# Altium schematic sheet Sheet3.SchDoc
size A4; SheetNumber: 1; SheetTotal: 1
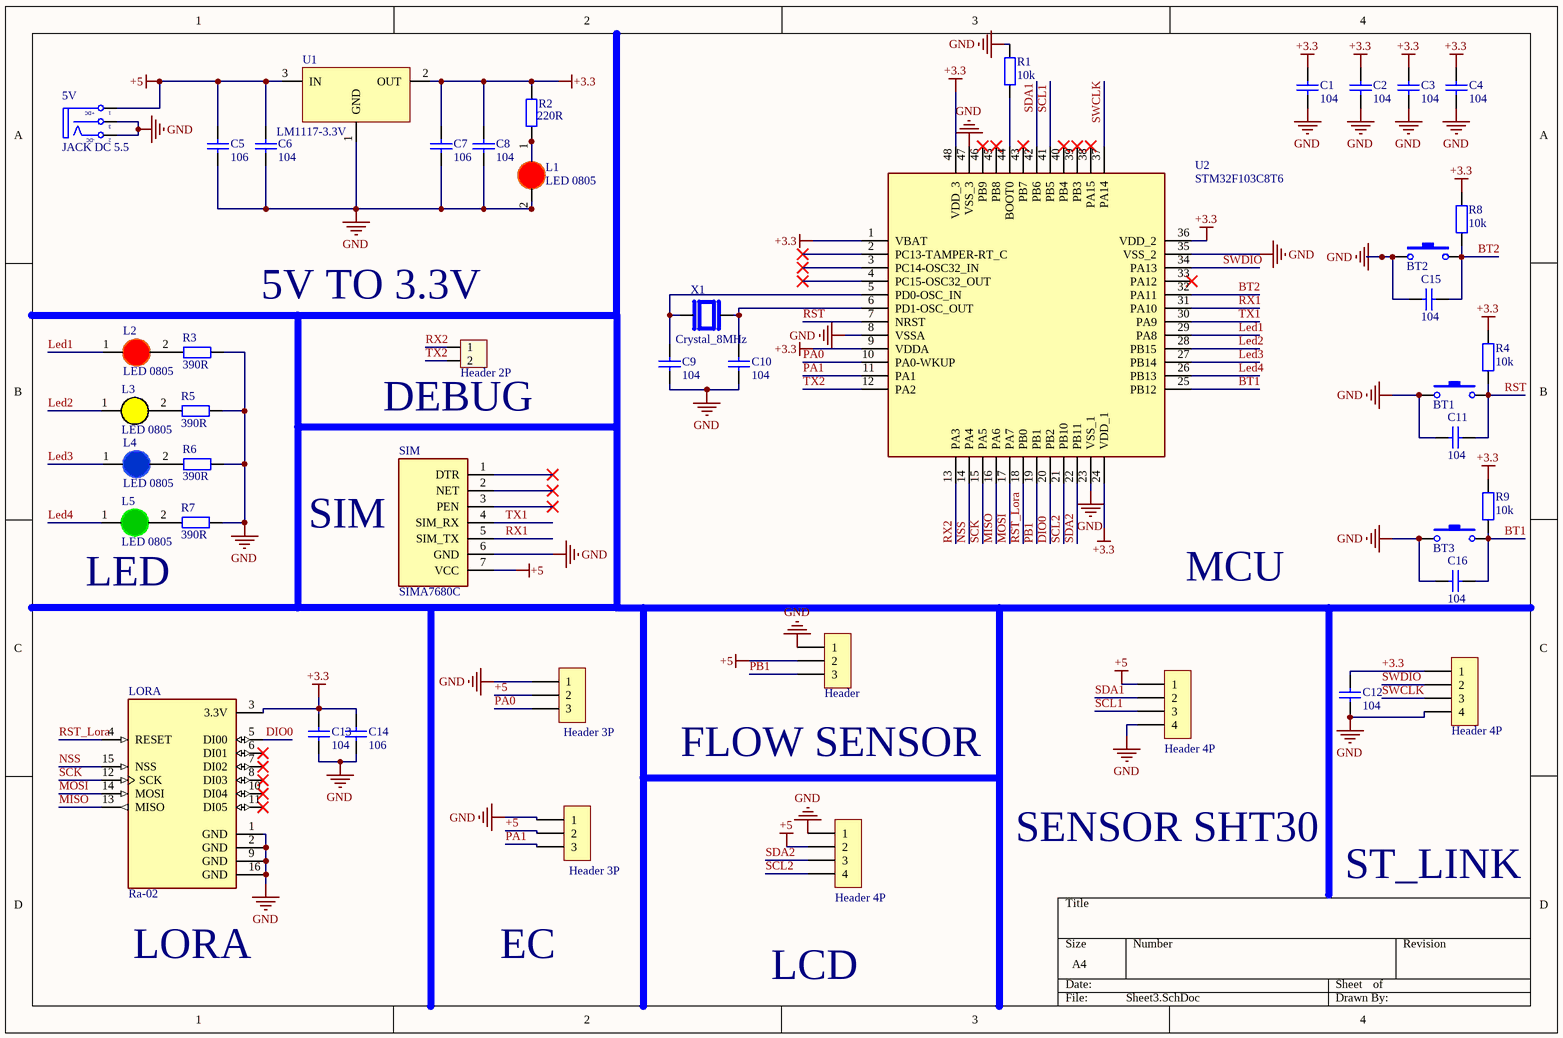
[diagram p0: Sheet3.SchDoc]

## Parts
5V  JACK DC 5.5  [JACK DC 5.5]
BT1  Nut Nhan 2 Chan SMD 3x6x2.5  [Nut Nhan 2 Chan SMD 3x6x2.5]  (value not drawn)
BT2  Nut Nhan 2 Chan SMD 3x6x2.5  [Nut Nhan 2 Chan SMD 3x6x2.5]  (value not drawn)
BT3  Nut Nhan 2 Chan SMD 3x6x2.5  [Nut Nhan 2 Chan SMD 3x6x2.5]  (value not drawn)
C1  104  [tu 1206]
C2  104  [tu 1206]
C3  104  [tu 1206]
C4  104  [tu 1206]
C5  106  [tu 1206]
C6  104  [tu 1206]
C7  106  [tu 1206]
C8  104  [tu 1206]
C9  104  [tu 1206]
C10  104  [tu 1206]
C11  104  [tu 1206]
C12  104  [tu 1206]
C13  104  [tu 1206]
C14  106  [tu 1206]
C15  104  [tu 1206]
C16  104  [tu 1206]
FLOW  Header  [XH2.54M-3]
L1  LED 0805  [LED-1206-Red]
L2  LED 0805  [LED-1206-Red]
L3  LED 0805  [LED-1206-Yellow]
L4  LED 0805  [LED-1206-Blue]
L5  LED 0805  [LED-1206-Green]
LCD  Header 4P  [XH2.54M-4]
LORA  Ra-02  [Sx1278]
R1  10k  [tro smd 1206]
R2  220R  [tro smd 1206]
R3  390R  [Tro smd 1206]
R4  10k  [tro smd 1206]
R5  390R  [Tro smd 1206]
R6  390R  [Tro smd 1206]
R7  390R  [Tro smd 1206]
R8  10k  [tro smd 1206]
R9  10k  [tro smd 1206]
SAL  Header 3P  [XH2.54M-3]
SHT3x  Header 4P  [XH2.54M-4]
SIM  SIMA7680C  [SIMA7680C]
ST  Header 4P  [XH2.54M-4]
TEMP_W  Header 3P  [XH2.54M-3]
U1  LM1117-3.3V  [SOT223]
U2  STM32F103C8T6  [LQFP-48_19.6_393_58X11_SMD]
UART2  Header 2P  [XH2.54M-2]
X1  Crystal_8MHz  [XTAL_8MHz]

## Nets
+3.3: C1.1 C2.1 C3.1 C4.1 C7.1 C8.1 C12.2 C13.1 C14.1 LORA.3(3.3V) R2.2 R4.2 R8.2 R9.2 ST.1 U1.2(OUT) U2.1(VBAT) U2.9(VDDA) U2.24(VDD_1) U2.36(VDD_2) U2.48(VDD_3)
+5: 5V.1(T) C5.1 C6.1 FLOW.2 LCD.2 SAL.2 SHT3x.1 SIM.7(VCC) TEMP_W.2 U1.3(IN)
GND: 5V.2(TN) 5V.3(S) BT1.1 BT2.1 BT3.1 C1.2 C2.2 C3.2 C4.2 C5.2 C6.2 C7.2 C8.2 C9.2 C10.2 C11.1 C12.1 C13.2 C14.2 C15.1 C16.1 FLOW.1 L1.2(K) LCD.1 LORA.1(GND) LORA.2(GND) LORA.9(GND) LORA.16(GND) R1.2 R3.1 R5.2 R6.2 R7.2 SAL.1 SHT3x.4 SIM.6(GND) ST.4 TEMP_W.1 U1.1(GND) U2.8(VSSA) U2.23(VSS_1) U2.35(VSS_2) U2.47(VSS_3)
BT1: BT3.2 C16.2 R9.1 U2.25(PB12)
BT2: BT2.2 C15.2 R8.1 U2.32(PA11)
DIO0: LORA.5(DI00) U2.20(PB2)
Led1: L2.1(A) U2.29(PA8)
Led2: L3.1(A) U2.28(PB15)
Led3: L4.1(A) U2.27(PB14)
Led4: L5.1(A) U2.26(PB13)
MISO: LORA.13(MISO) U2.16(PA6)
MOSI: LORA.14(MOSI) U2.17(PA7)
NSS: LORA.15(NSS) U2.14(PA4)
PA0: SAL.3 U2.10(PA0-WKUP)
PA1: TEMP_W.3 U2.11(PA1)
PB1: FLOW.3 U2.19(PB1)
RST: BT1.2 C11.2 R4.1 U2.7(NRST)
RST_Lora: LORA.4(RESET) U2.18(PB0)
RX1: SIM.5(SIM_TX) U2.31(PA10)
RX2: U2.13(PA3) UART2.1
SCK: LORA.12(SCK) U2.15(PA5)
SCL1: SHT3x.3 U2.41(PB5)
SCL2: LCD.4 U2.21(PB10)
SDA1: SHT3x.2 U2.42(PB6)
SDA2: LCD.3 U2.22(PB11)
SWCLK: ST.3 U2.37(PA14)
SWDIO: ST.2 U2.34(PA13)
TX1: SIM.4(SIM_RX) U2.30(PA9)
TX2: U2.12(PA2) UART2.2
NetC9_1: C9.1 U2.5(PD0-OSC_IN) X1.1
NetC10_1: C10.1 U2.6(PD1-OSC_OUT) X1.2
NetL1_1: L1.1(A) R2.1
NetL2_2: L2.2(K) R3.2
NetL3_2: L3.2(K) R5.1
NetL4_2: L4.2(K) R6.1
NetL5_2: L5.2(K) R7.1
NetR1_1: R1.1 U2.44(BOOT0)

Not connected (* = marked no-connect by the designer): LORA 6(DI01)* 7(DI02)* 8(DI03)* 10(DI04)* 11(DI05)*; SIM 1(DTR)* 2(NET)* 3(PEN)*; U2 2(PC13-TAMPER-RT_C)* 3(PC14-OSC32_IN)* 4(PC15-OSC32_OUT)* 33(PA12)* 38(PA15)* 39(PB3)* 40(PB4)* 43(PB7)* 45(PB8)* 46(PB9)*

## Notes on the sheet
- (near UART2) 5V TO 3.3V
- (near UART2) DEBUG
- SIM
- MCU
- LED
- FLOW SENSOR
- SENSOR SHT30
- ST_LINK
- (near LORA) LORA
- EC
- LCD
- (in symbol JACK DC 5.5) +DC; -DC

## Library data of the parts
5V = JACK DC 5.5: Value: Jac DC
BT1-BT3 = Nut Nhan 2 Chan SMD 3x6x2.5: Ma_Hang: MH001036; Ten: Nút Nhấn 2 Chân 3x6x2.5MM SMD
C1-C4 C6 C8-C13 C15 C16 = Tu 1206 104 50V 20%: Dán; Don_Vi: Con; So_Chan: 2; Ten_Linh_Kien: Tụ 1206 104-0.1uF 20% 50V; Ma_Hang: MH004544; Chung_Loai: Dán; Kieu_Chan: *
C5 C7 C14 = Tu 1206 106 16V 20%: Dán; Don_Vi: Con; So_Chan: 2; Ten_Linh_Kien: Tụ 1206 106-10uF 20% 16V; Ma_Hang: MH004541; Chung_Loai: Dán; Kieu_Chan: *
FLOW SAL TEMP_W = Header 3P 2.54 Duc Thang: Cắm; Ten_Linh_Kien: Header 3P XH2.54-3P Đực Thẳng; Don_Vi: Con; Ma_Hang: MH001292; Chung_Loai: Cắm
L1 L2 = LED 1206 Do: Dán; Don_Vi: Con; Ma_Hang: MH002334; Ten_Linh_Kien: LED1206 Màu Đỏ (Red); Ghi_Chu: *; Kieu_Chan: *; Chung_Loai: Dán
L3 = LED 1206 Vang: Dán; Don_Vi: Con; Ma_Hang: MH002331; Ten_Linh_Kien: LED1206 Màu Vàng (Yellow); Ghi_Chu: *; Kieu_Chan: *; Chung_Loai: Dán
L4 = LED 1206 Xanh Duong: Dán; Don_Vi: Con; Ma_Hang: MH002333; Ten_Linh_Kien: LED1206 Màu Xanh Dương (Blue); Ghi_Chu: *; Kieu_Chan: *; Chung_Loai: Dán
L5 = LED 1206 Xanh La: Dán; Don_Vi: Con; Ma_Hang: MH002947; Ten_Linh_Kien: LED1206 Màu Xanh Lá (Green); Ghi_Chu: *; Kieu_Chan: *; Chung_Loai: Dán
LCD SHT3x ST = Header 4P 2.54 Duc Thang: Cắm; Ten_Linh_Kien: Header 4P XH2.54-4P Đực Thẳng; Don_Vi: Con; Ma_Hang: MH001285; Chung_Loai: Cắm
LORA = Ra-02: Lora sx1278
R1 R4 R8 R9 = Tro 1206 1% 10k: Dán; Don_Vi: Con; So_Chan: 2; Ten_Linh_Kien: Trở 1206 1% 10k; Ma_Hang: MH005885; Chung_Loai: Dán; Kieu_Chan: *
R2 = Tro 1206 1% 220R: Dán; Ma_Hang: MH005897; Don_Vi: Con; So_Chan: 2; Ten_Linh_Kien: Trở 1206 1% 220R; Chung_Loai: Dán; Kieu_Chan: *
R3 R5-R7 = Tro 1206 5% 390R: Dán; Don_Vi: Con; So_Chan: 2; Ten_Linh_Kien: Trở 1206 5% 390R; Ma_Hang: MH005927; Chung_Loai: Dán; Kieu_Chan: *
U1 = LM1117: 800mA Low-Dropout Linear Regulator; Creator: Nguyen Ba Bien; Website: http://group3i.net
U2 = IC_STM32F103C8T6: ARM® Cortex®-M3 STM32F1 Microcontroller IC 32-Bit 72MHz 64KB (64K x 8) FLASH 48-LQFP (7x7) /; Manufacturer: STMicroelectronics; Alternate Part Number-1: NA; Manufacturer Part Number: STM32F103C8T6; Case/Package: LQFP48; Supplier-1: LCSC; Supplier Part Number-1: STM32F103C8T6
UART2 = Header 2P 2.54 Duc Thang: Cắm; Ten_Linh_Kien: Header 2P XH2.54-2P Đực Thẳng; Don_Vi: Con; Ma_Hang: MH001283; Chung_Loai: Cắm
X1 = Crystal_8MHz: 8MHz